# EAGLE design vssb_PTH (EAGLE 7.1.0)
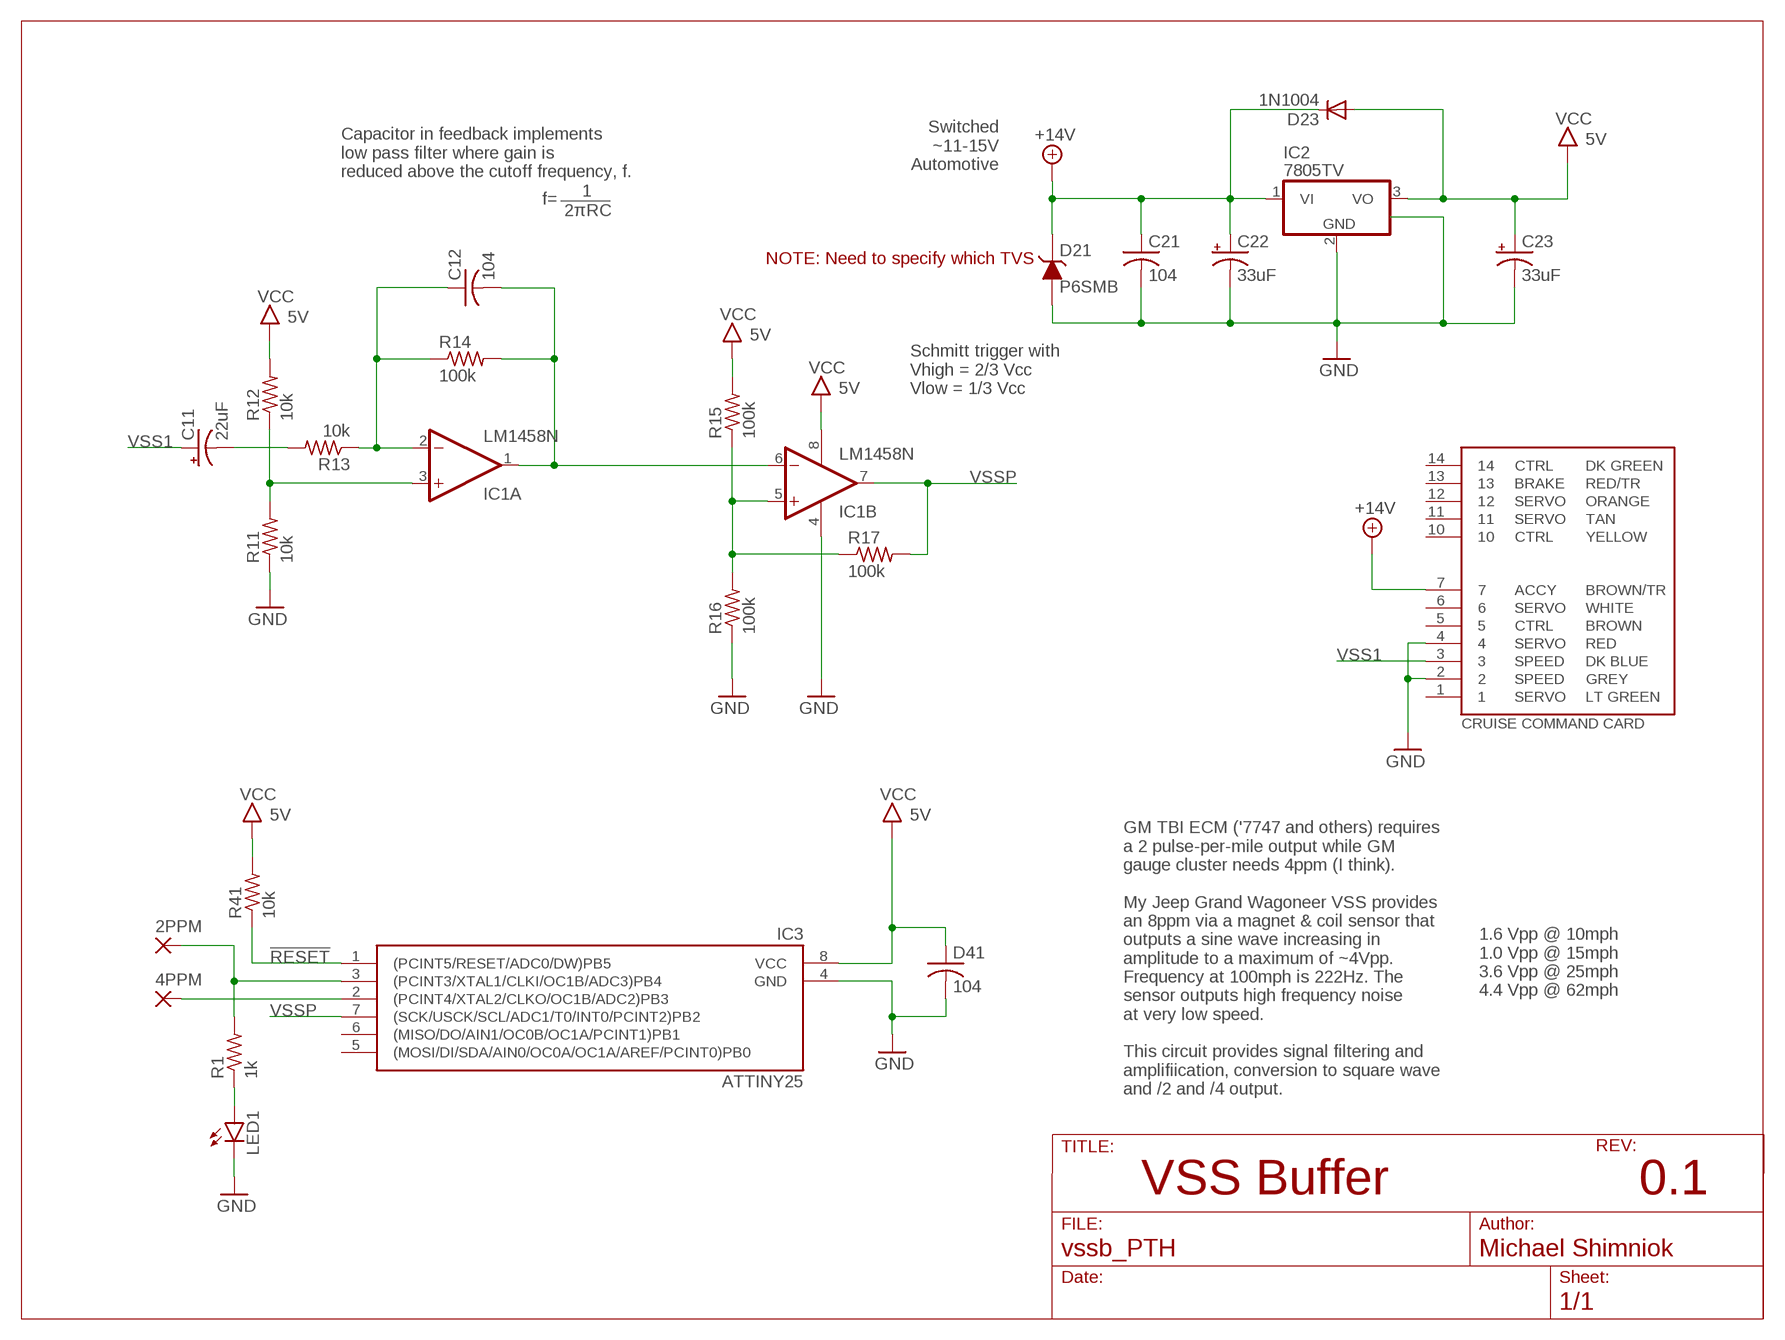
[diagram p0: schematic, sheet 1]

## Parts
2PPM  WIREPAD3,17/1,3  [3,17/1,3]
4PPM  WIREPAD3,17/1,3  [3,17/1,3]
C11  22uF  CPOL-USE5-5  [E5-5]
C12  104  C-US050-024X044  [C050-024X044]
C21  104  C-US050-024X044  [C050-024X044]
C22  33uF  CPOL-USE2.5-6  [E2,5-6]
C23  33uF  CPOL-USE2.5-6  [E2,5-6]
D21  P6SMB  P6SMBXXAT3GSMA  [DO-214AA]
D23  1N1004  1N4004  [DO41-10]
D41  104  C-US050-024X044  [C050-024X044]
IC1  LM1458N  [DIL08]
IC2  7805TV  [TO220V]
IC3  ATTINY25  ATTINY45/85-MU  [DIL08]
LED1  LED3MM  [LED3MM]
R1  1k  R-US_0204/5  [0204/5]
R11  10k  R-US_0204/5  [0204/5]
R12  10k  R-US_0204/5  [0204/5]
R13  10k  R-US_0204/5  [0204/5]
R14  100k  R-US_0204/5  [0204/5]
R15  100k  R-US_0204/5  [0204/5]
R16  100k  R-US_0204/5  [0204/5]
R17  100k  R-US_0204/5  [0204/5]
R41  10k  R-US_0204/5  [0204/5]
U$4  FSJ_CC_CARD  [FSJ_CC]

## Nets
!RESET: IC3.1((PCINT5/RESET/ADC0/DW)PB5) R41.1
+14V: C21.1 C22.+ D21.P$1(C) D23.C IC2.1(VI) U$4.7
/2: 2PPM.1(P) IC3.3((PCINT3/XTAL1/CLKI/OC1B/ADC3)PB4) R1.2
GND: C21.2 C22.- C23.- D21.P$2(A) D41.2 IC1.4(P:V-) IC2.2(GND) IC3.4(GND) LED1.K(C) R11.1 R16.1 U$4.2 U$4.4
N$1: C11.- R13.2
N$2: C12.1 IC1.2(A:-IN) R13.1 R14.1
N$3: IC1.3(A:+IN) R11.2 R12.1
N$4: IC1.5(B:+IN) R15.1 R16.2 R17.1
N$5: LED1.A R1.1
N$6: 4PPM.1(P) IC3.2((PCINT4/XTAL2/CLKO/OC1B/ADC2)PB3)
OUT1: C12.2 IC1.1(A:OUT) IC1.6(B:-IN) R14.2
VCC: C23.+ D23.A D41.1 IC1.8(P:V+) IC2.3(VO) IC3.8(VCC) R12.2 R15.2 R41.2 ; supply symbol labelled 5V
VSS1: C11.+ U$4.3
VSSP: IC1.7(B:OUT) IC3.7((SCK/USCK/SCL/ADC1/T0/INT0/PCINT2)PB2) R17.2
Unconnected: IC3.5((MOSI/DI/SDA/AIN0/OC0A/OC1A/AREF/PCINT0)PB0) IC3.6((MISO/DO/AIN1/OC0B/OC1A/PCINT1)PB1) U$4.1 U$4.5 U$4.6 U$4.10 U$4.11 U$4.12 U$4.13 U$4.14

## Notes on the sheet
- Capacitor in feedback implements
  low pass filter where gain is
  reduced above the cutoff frequency, f.
- Switched
  ~11-15V
  Automotive
- 1
- f=
- 2πRC
- NOTE: Need to specify which TVS
- Schmitt trigger with 
  Vhigh = 2/3 Vcc
  Vlow = 1/3 Vcc
- GM TBI ECM ('7747 and others) requires
  a 2 pulse-per-mile output while GM
  gauge cluster needs 4ppm (I think). 
  
  My Jeep Grand Wagoneer VSS provides
  an 8ppm via a magnet & coil sensor that
  outputs a sine wave increasing in
  amplitude to a maximum of ~4Vpp.
  Frequency at 100mph is 222Hz. The
  sensor outputs high frequency noise
  at very low speed.
  
  This circuit provides signal filtering and
  amplifiication, conversion to square wave
  and /2 and /4 output.
- 1.6 Vpp @ 10mph
  1.0 Vpp @ 15mph
  3.6 Vpp @ 25mph
  4.4 Vpp @ 62mph
- VSS Buffer | 0.1

## Library data of the parts
2PPM 4PPM = wirepad:WIREPAD: Wire PAD connect wire on PCB
C11 C22 C23 = rcl:CPOL-US: POLARIZED CAPACITOR, American symbol
C12 C21 D41 = rcl:C-US: CAPACITOR, American symbol
D21 = bt_diode:P6SMBXXAT3G: SMBxxAT3G TVS Diode The SMB series is designed to protect voltage sensitive components from high voltage, high energy transients. They have excellent clamping capability, high surge capability, low zener impedance and fast response time. The SMB series is supplied in ON Semiconductor’s exclusive, cost-effective, highly reliable SURMETIC® package and is ideally suited for use in communication systems, automotive, numerical controls, process controls, medical equipment, business machines, power supplies and many other industrial/consumer applications. http://www.onsemi.com/pub_link/Collateral/P6SMB6.8AT3-D.PDF <datasheet.pdf>
D23 = diode:1N4004: DIODE general purpose rectifier, 1 A
IC1 = bt_linear:*1458: OP AMP
IC2 = linear:78*: Positive VOLTAGE REGULATOR Source: http://cache.national.com/ds/LM/LM78L05.pdf http://www.fairchildsemi.com/ds/LM/LM7805.pdf
IC3 = bt_avr:ATTINY45/85
LED1 = bt_opto:LED: LED Various packages
R1 R11-R17 R41 = rcl:R-US_: RESISTOR, American symbol
U$4 = bt:FSJ_CC_CARD: FSJ Cruise Command Card Card edge pads for Cruise Command (cruise control) module found in Full Size Jeeps and some AMC cars. The card edge connector is single-sided with 14 pins, of which two are not used, with a locator slot / terminal release between pins 8 and 9. The pads are spaced on a 5/32" pitch and are approximately 0.080 in. wide.

## Board
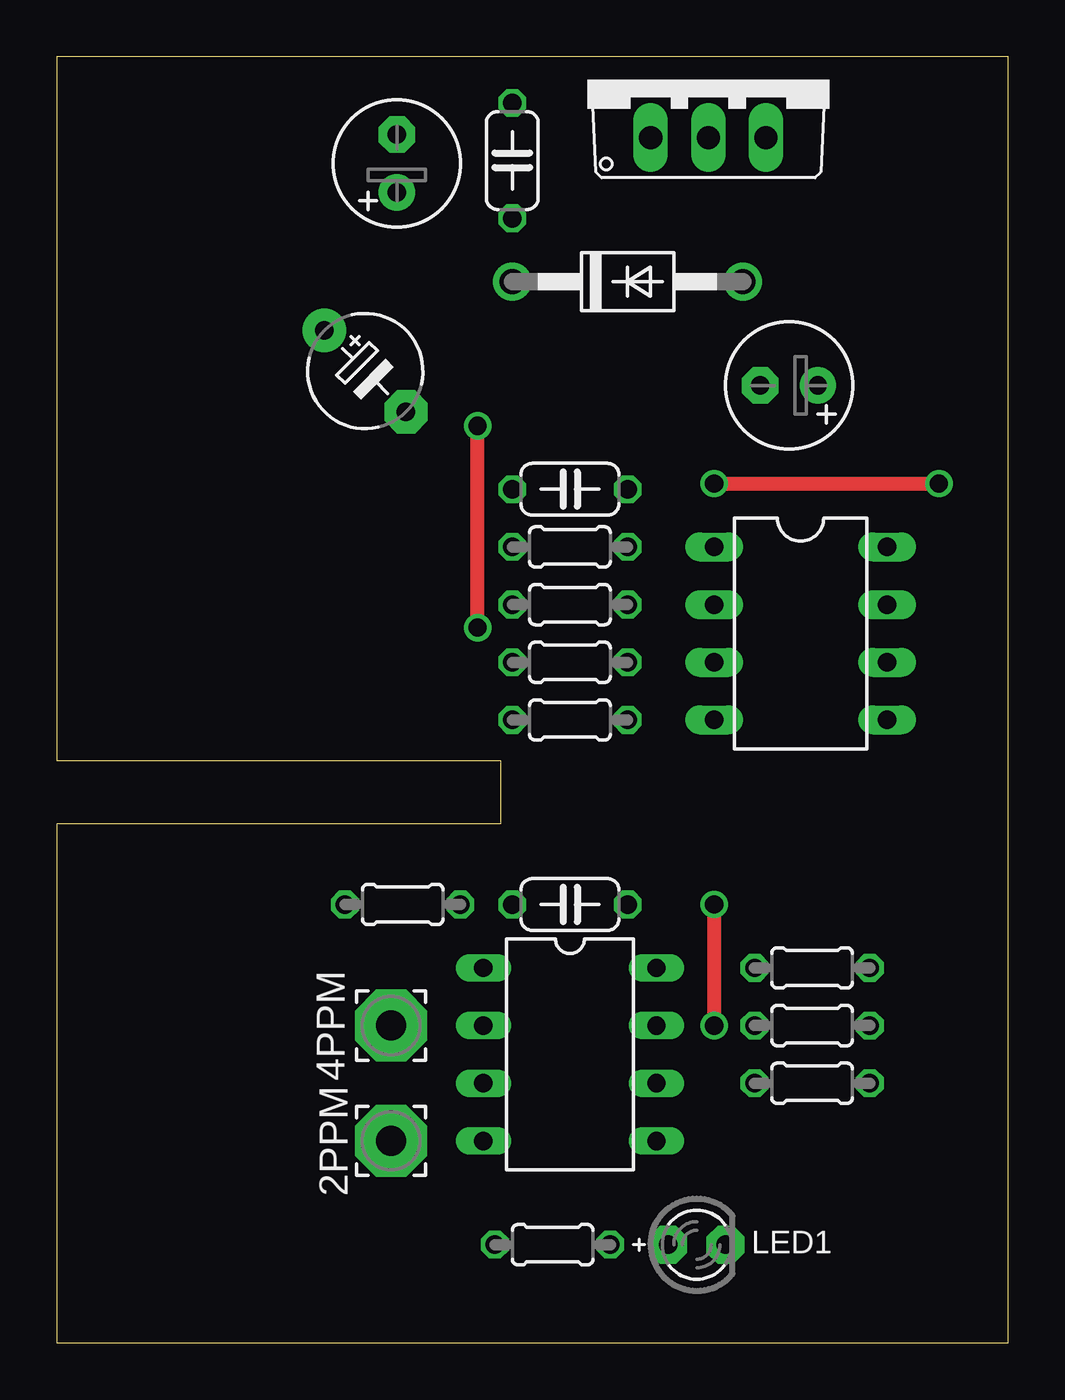
[diagram p1: board, top side]
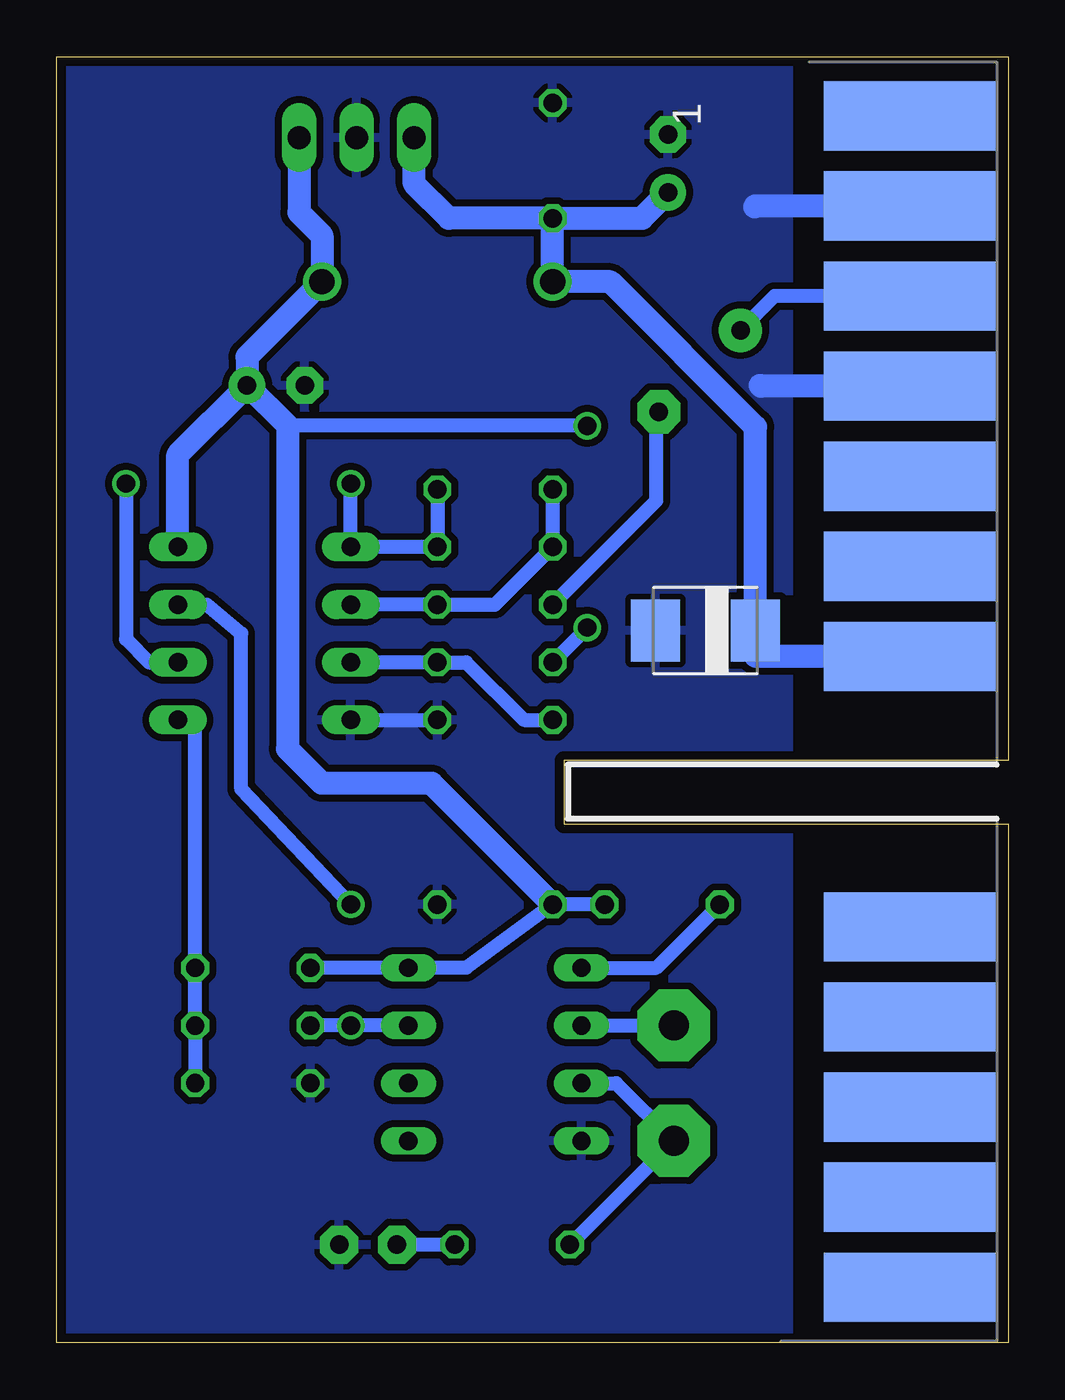
[diagram p2: board, bottom side, seen from below]

Size 41.91 x 56.64 mm. Coordinates in mm from the lower left corner, seen from the top.
Outline: 0,0 41.91,0 41.91,56.64 0,56.64 0,25.65 19.56,25.65 19.56,22.86 0,22.86 0,0
Copper layers (1*16): Top 0.0356mm / dielectric 1.5011mm / Bottom 0.0356mm
Design rules "LaenPCBOrder *": minimum track width 6mil, minimum drill 13mil, track to track 10mil, track to pad 10mil, pad to pad 10mil, via to via 10mil, smd to smd 8mil, copper to edge 16mil, drill to drill 16mil, minimum pad ring 7mil, minimum via ring 7mil, stop-mask expansion 3mil, vias tented up to drill 20mil, thermal gap 10mil

### Footprints (pad centres in the part's own frame; a part is rotated, then mirrored left to right if it is on the bottom)
3,17/1,3 = drill 1.321 pad 3.175 octagon: 1 0,0
E5-5 = drill 0.813 pad 1.905: + -2.54,0 | drill 0.813 pad 1.905 octagon: - 2.54,0
C050-024X044 = drill 0.813 octagon: 1 -2.54,0; 2 2.54,0
E2,5-6 = drill 0.813 pad 1.6: + -1.27,0 | drill 0.813 pad 1.6 octagon: - 1.27,0
DO-214AA = smd 2.159 x 2.743: P$1 -2.21,0; P$2 2.21,0
DO41-10 = drill 1.118: A 5.08,0; C -5.08,0
DIL08 = drill 0.813 pad 1.27 long: 1 -3.81,-3.81; 2 -1.27,-3.81; 3 1.27,-3.81; 4 3.81,-3.81; 5 3.81,3.81; 6 1.27,3.81; 7 -1.27,3.81; 8 -3.81,3.81
TO220V = drill 1.016 long: 1 -2.54,-2.54; 2 0,-2.54; 3 2.54,-2.54
DIL08' = drill 0.813 long: 1 -3.81,-3.81; 2 -1.27,-3.81; 3 1.27,-3.81; 4 3.81,-3.81; 5 3.81,3.81; 6 1.27,3.81; 7 -1.27,3.81; 8 -3.81,3.81
LED3MM = drill 0.813 pad 1.676 octagon: A -1.27,0; K 1.27,0
0204/5 = drill 0.813 octagon: 1 -2.54,0; 2 2.54,0
FSJ_CC = smd 7.62 x 3.048 bottom: 1 -3.81,2.381; 2 -3.81,6.35; 3 -3.81,10.319; 4 -3.81,14.287; 5 -3.81,18.256; 6 -3.81,22.225; 7 -3.81,26.194; 10 -3.81,38.1; 11 -3.81,42.069; 12 -3.81,46.038; 13 -3.81,50.006; 14 -3.81,53.975

### Placement (x,y rotation side)
2PPM  14.73,8.89 90 top
4PPM  14.73,13.97 90 top
C11  13.59,42.8 315 top
C12  22.61,37.59 0 top
C21  20.07,52.07 90 top
C22  14.99,51.94 90 top
C23  32.26,42.16 180 top
D21  13.34,31.37 180 bottom
D23  25.15,46.74 0 top
D41  22.61,19.3 0 top
IC1  32.77,31.24 270 top
IC2  28.7,55.63 0 top
IC3  ATTINY25  [DIL08']  22.61,12.7 270 top
LED1  28.19,4.32 0 top
R1  21.84,4.32 180 top
R11  22.61,27.43 180 top
R12  22.61,29.97 180 top
R13  22.61,32.51 180 top
R14  22.61,35.05 0 top
R15  33.27,16.51 180 top
R16  33.27,11.43 0 top
R17  33.27,13.97 180 top
R41  15.24,19.3 0 top
U$4  0.51,56.42 180 top

### Tracks (layer width: path | path; a pad name or v marks a point on that pad's centre or on a via)
!RESET
  Bottom 0.61: IC3.1 15.49,16.51 R41.1
+14V
  Bottom 1.016: U$4.7 11.12,30.23 D21.P$1 11.12,40.34 17.53,46.74 D23.C C21.1 | C21.1 16.13,49.53 C22.+ | C21.1 24.64,49.53 26.16,51.05 IC2.1
/2
  Bottom 0.61: IC3.3 17.27,11.43 2PPM.1 R1.2
GND
  Bottom 0.61: IC1.4 R11.1
  Bottom 1.016: U$4.2 11.14,50.07 11.18,50.04 | U$4.4 10.89,42.13 10.92,42.16
  pour Bottom (isolate 0.305): 9.65,56.64 41.91,56.64 41.91,0.25 9.65,0.25
N$1
  Bottom 0.61: R13.2 15.49,37.08 15.49,40.89 C11.-
N$2
  Bottom 0.61: IC1.2 R13.1 22.61,32.51 R14.1 C12.1
N$3
  Bottom 0.61: R11.2 21.34,27.43 23.88,29.97 R12.1 IC1.3
N$4
  Bottom 0.61: R16.2 R17.1 R15.1 35.81,27.43 IC1.5
N$5
  Bottom 0.61: R1.1 LED1.A
N$6
  Bottom 0.61: IC3.2 4PPM.1
OUT1  (via drill 0.8)
  Top 0.61: v28.96,37.85 v38.86,37.85
  Bottom 0.61: C12.2 R14.2 IC1.1 v28.96,37.85 | v38.86,37.85 38.86,30.99 37.85,29.97 IC1.6
VCC  (via drill 0.8)
  Top 0.61: v18.54,31.5 v18.54,40.39
  Bottom 0.61: R15.2 IC3.8 23.88,16.51 D41.1 R41.2 | R12.2 v18.54,31.5 | v18.54,40.39 31.75,40.39
  Bottom 1.016: IC2.3 31.24,49.78 30.23,48.77 D23.A 33.53,43.43 C23.+ | IC1.8 36.58,39.12 C23.+ | C23.+ 31.75,40.39 31.75,26.16 30.23,24.64 25.4,24.64 D41.1
VSS1
  Bottom 0.61: U$4.3 10.29,46.1 C11.+
VSSP  (via drill 0.8)
  Top 0.61: v28.96,19.3 v28.96,13.97
  Bottom 0.61: IC1.7 35.31,32.51 33.78,31.24 33.78,24.38 v28.96,19.3 | IC3.7 v28.96,13.97 R17.2